# Altium project PICO核心板.PrjPcb
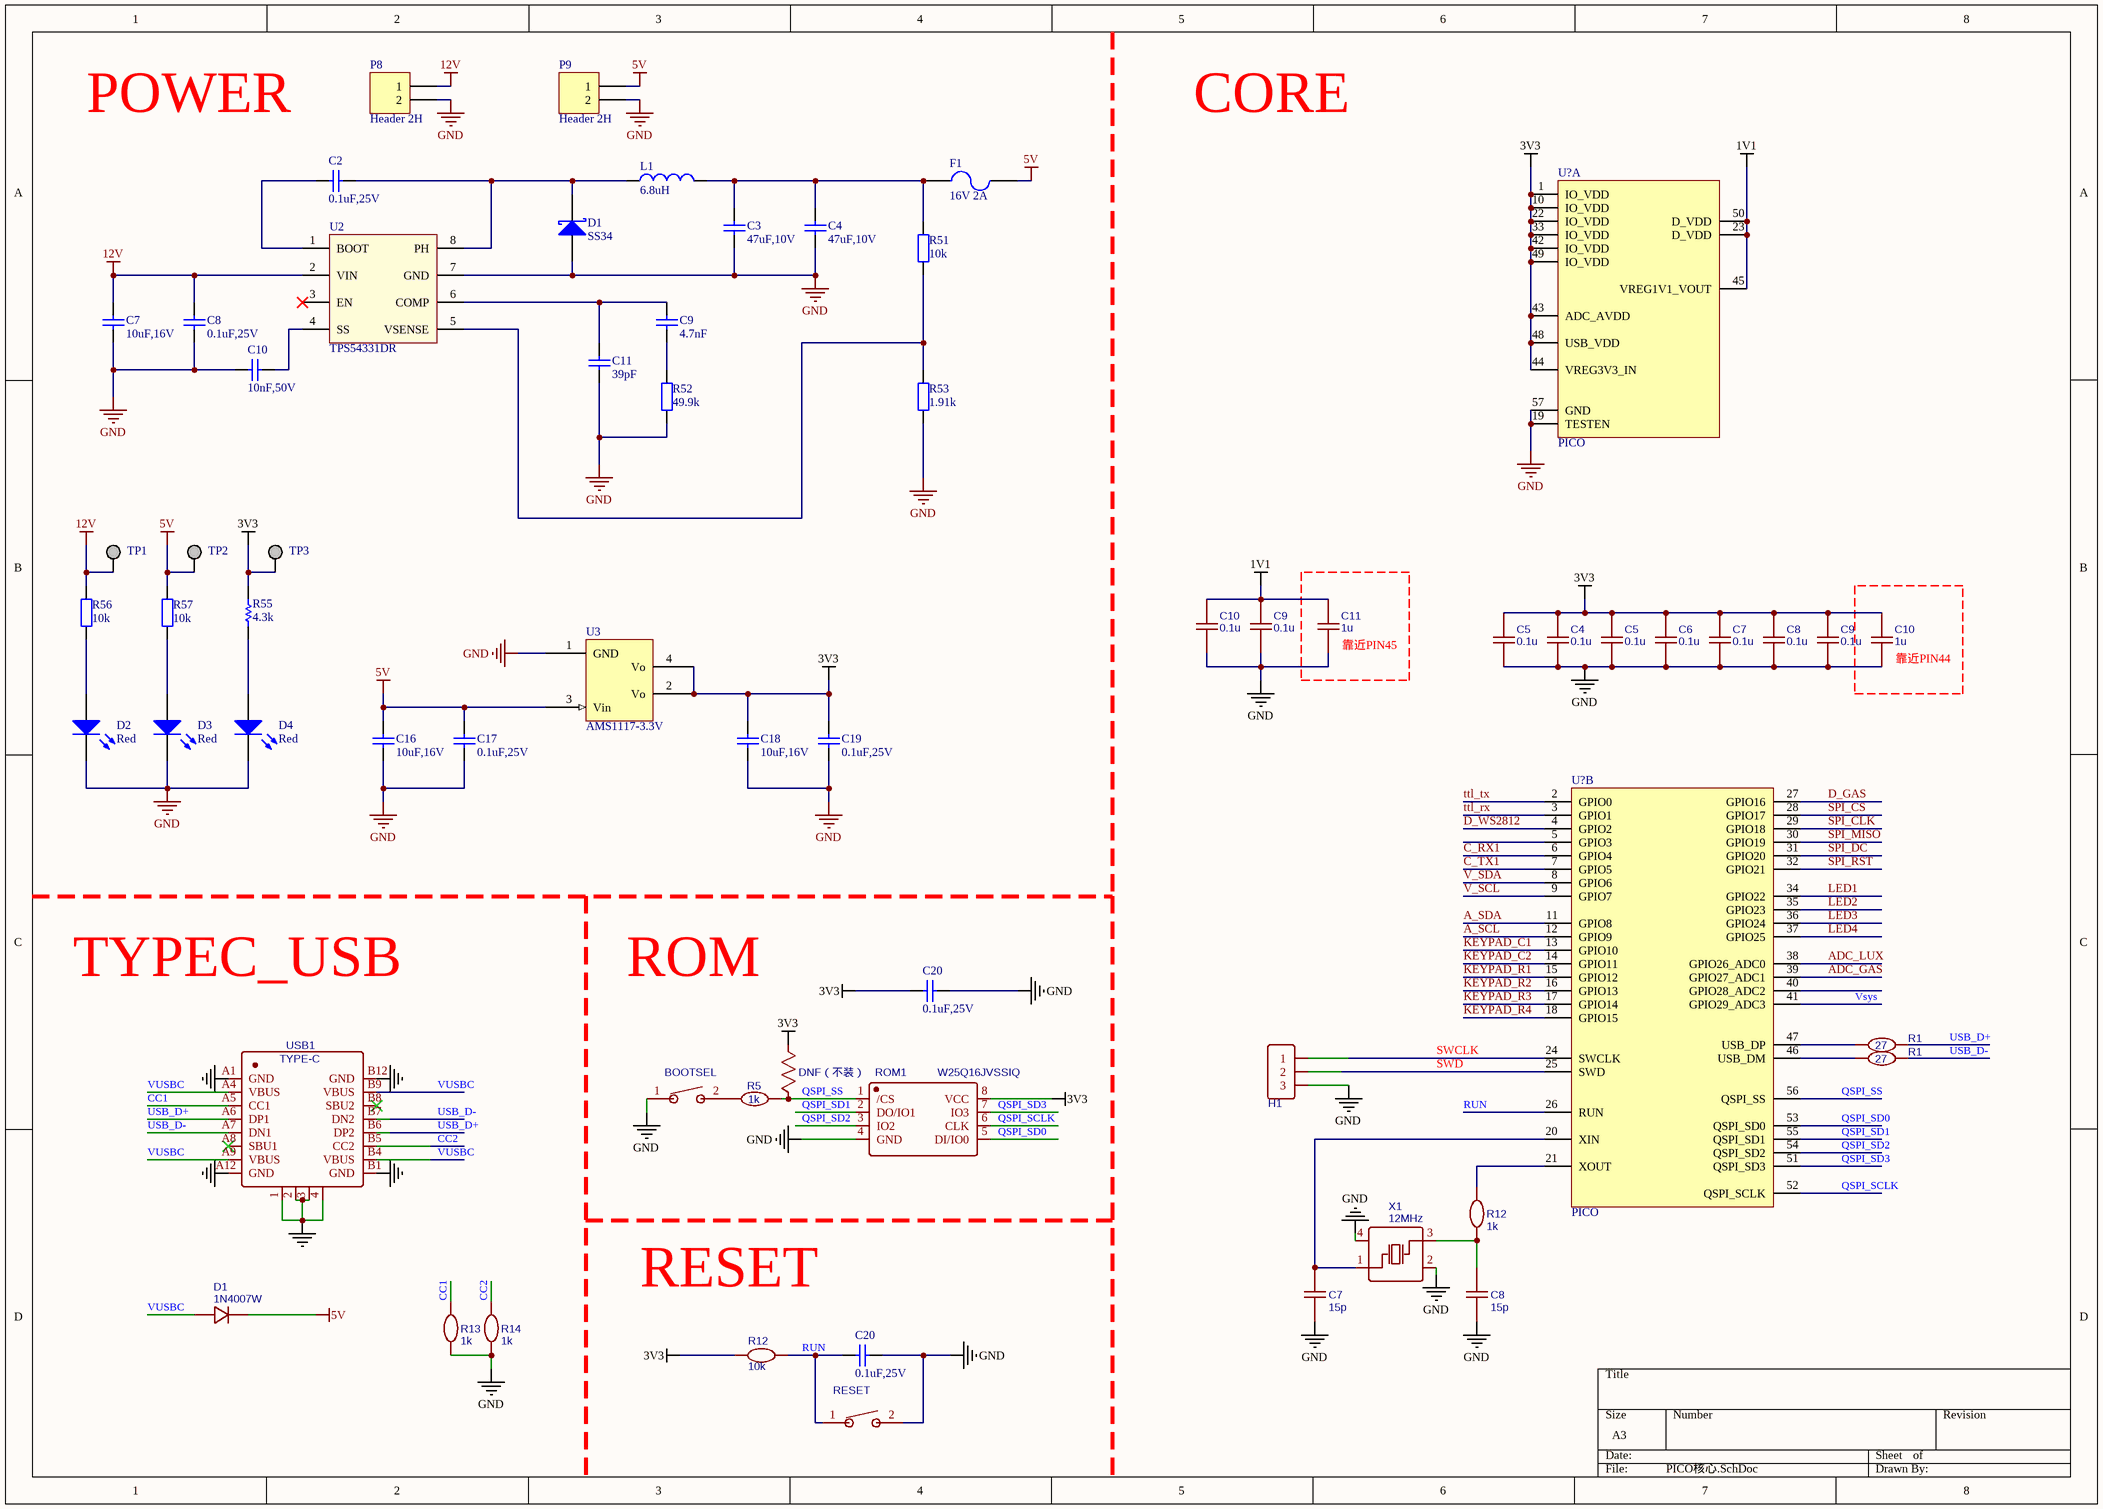
[diagram p0: PICO核心.SchDoc]
3 sheets, 124 parts. Net scope: global (net labels, ports and power ports of the same name join across sheets).
Board file: PICO核心.PcbDoc
Sheets:
  PICO核心.SchDoc
  传感器.SchDoc
  外设.SchDoc

## Sheet PICO核心.SchDoc
size A3

### Parts
(Parts that share a designator on the sheet are numbered #1, #2 ... from top to bottom, then left to right.)
BOOTSEL  TSA343G00-250J2  [SW-SMD_L4.0-W2.9-LS5.0]  (value not drawn)
C2  value 0.1uF,25V  [0603_C]  (hidden comment: Cap)
C3  value 47uF,10V  [1206_C]  (hidden comment: Cap)
C4#1  value 47uF,10V  [1206_C]  (hidden comment: Cap)
C4#2  0.1u  [C0603 NSK]
C5#1  0.1u  [C0603 NSK]
C5#2  0.1u  [C0603 NSK]
C6#1  0.1u  [C0603 NSK]
C7#1  value 10uF,16V  [0603_C]  (hidden comment: Cap)
C7#2  0.1u  [C0603 NSK]
C7#3  15p  [C0603 NSK]
C8#1  value 0.1uF,25V  [0603_C]  (hidden comment: Cap)
C8#2  0.1u  [C0603 NSK]
C8#3  15p  [C0603 NSK]
C9#1  4.7nF  [0603_C]
C9#2  0.1u  [C0603 NSK]
C9#3  0.1u  [C0603 NSK]
C10#1  value 10nF,50V  [0603_C]  (hidden comment: Cap)
C10#2  0.1u  [C0603 NSK]
C10#3  1u  [C0603 NSK]
C11#1  39pF  [0603_C]
C11#2  1u  [C0603 NSK]
C16  value 10uF,16V  [0603_C]  (hidden comment: Cap)
C17  value 0.1uF,25V  [0603_C]  (hidden comment: Cap)
C18  value 10uF,16V  [0603_C]  (hidden comment: Cap)
C19  value 0.1uF,25V  [0603_C]  (hidden comment: Cap)
C20#1  value 0.1uF,25V  [0603_C]  (hidden comment: Cap)
C20#2  value 0.1uF,25V  [0603_C]  (hidden comment: Cap)
D1#1  value SS34  [DO-214AC]  (hidden comment: Diode Schottky)
D1#2  1N4007W  [SOD-123 NSK]
D2  value Red  [0805_LED]  (hidden comment: LED)
D3  value Red  [0805_LED]  (hidden comment: LED)
D4#1  value Red  [0805_LED]  (hidden comment: LED)
F1  16V 2A  [PTC-1812]
H1  HDR-F-2.54_1x3  [HDR-F-2.54_1X3]  (value not drawn)
L1  6.8uH  [6045_L]
P8  Header 2H  [KF2EDGK3.50H-2P]
P9  Header 2H  [KF2EDGK3.50H-2P]
R1#1  27  [R0603 NSK]
R1#2  27  [R0603 NSK]
R4  DNF（不装）  [R0603 NSK]
R5#1  1k  [R0603 NSK]
R12#1  1k  [R0603 NSK]
R12#2  10k  [R0603 NSK]
R13#1  1k  [R0603 NSK]
R14  1k  [R0603 NSK]
R51  value 10k  [0603_R]  (hidden comment: Res)
R52  49.9k  [0603_R]
R53  1.91k  [0603_R]
R55#1  value 4.3k  [0603_R]  (hidden comment: Res_5%)
R56#1  value 10k  [0603_R]  (hidden comment: Res)
R57#1  value 10k  [0603_R]  (hidden comment: Res)
RESET  TSA343G00-250J2  [SW-SMD_L4.0-W2.9-LS5.0]  (value not drawn)
ROM1  W25Q16JVSSIQ  [SOIC-8_L5.3-W5.3-P1.27-LS8.0-BL]
TP1  TP  [TP_H]  (value not drawn)  (no BOM)
TP2  TP  [TP_H]  (value not drawn)  (no BOM)
TP3#1  TP  [TP_H]  (value not drawn)  (no BOM)
U2  TPS54331DR  [SOIC8E]
U3#1  value AMS1117-3.3V  [SOT223]  (hidden comment: AMS1117)
U?#1  PICO  (part A of 2)
U?#2  PICO  (part B of 2)
USB1  TYPE-C  [USB-C-SMD_TYC-302-16]
X1  12MHz  [OSC-SMD_4P-L3.2-W2.5-BL-1]

### Blocks framed on the sheet
靠近PIN45: C11#2
靠近PIN44: C10#3

### Nets
1V1: C9#2.1 C10#2.1 C11#2.2 U?#1.23(D_VDD) U?#1.45(VREG1V1_VOUT) U?#1.50(D_VDD)
3V3: C4#2.2 C5#1.1 C5#2.2 C6#1.2 C7#2.2 C8#2.2 C9#3.2 C10#3.2 C18.2 C19.2 C20#1.2 R4.2 R12#2.2 R55#1.2 ROM1.8(VCC) TP3#1.1 U3#1.2(Vo) U3#1.4(Vo) U?#1.1(IO_VDD) U?#1.10(IO_VDD) U?#1.22(IO_VDD) U?#1.33(IO_VDD) U?#1.42(IO_VDD) U?#1.43(ADC_AVDD) U?#1.44(VREG3V3_IN) U?#1.48(USB_VDD) U?#1.49(IO_VDD)
5V: C16.2 C17.2 D1#2.1 F1.2 P9.1 R57#1.2 TP2.1 U3#1.3(Vin)
12V: C7#1.2 C8#1.2 P8.1 R56#1.2 TP1.1 U2.2(VIN)
GND: BOOTSEL.1 C3.1 C4#1.1 C4#2.1 C5#1.2 C5#2.1 C6#1.1 C7#1.1 C7#2.1 C7#3.1 C8#1.1 C8#2.1 C8#3.1 C9#2.2 C9#3.1 C10#1.2 C10#2.2 C10#3.1 C11#1.1 C11#2.1 C16.1 C17.1 C18.1 C19.1 C20#1.1 C20#2.2 D1#1.1(A) D2.2(K) D3.2(K) D4#1.2(K) H1.3 P8.2 P9.2 R13#1.1 R14.1 R52.1 R53.1 RESET.2 ROM1.4(GND) U2.7(GND) U3#1.1(GND) U?#1.19(TESTEN) U?#1.57(GND) USB1.1 USB1.2 USB1.3 USB1.4 USB1.A1(GND) USB1.A12(GND) USB1.B1(GND) USB1.B12(GND) X1.2(GND) X1.4(GND)
A_SCL: U?#2.12(GPIO9)
A_SDA: U?#2.11(GPIO8)
ADC_GAS: U?#2.39(GPIO27_ADC1)
ADC_LUX: U?#2.38(GPIO26_ADC0)
C_RX1: U?#2.6(GPIO4)
C_TX1: U?#2.7(GPIO5)
CC1: R13#1.2 USB1.A5(CC1)
CC2: R14.2 USB1.B5(CC2)
D_GAS: U?#2.27(GPIO16)
D_WS2812: U?#2.4(GPIO2)
KEYPAD_C1: U?#2.13(GPIO10)
KEYPAD_C2: U?#2.14(GPIO11)
KEYPAD_R1: U?#2.15(GPIO12)
KEYPAD_R2: U?#2.16(GPIO13)
KEYPAD_R3: U?#2.17(GPIO14)
KEYPAD_R4: U?#2.18(GPIO15)
LED1: U?#2.34(GPIO22)
LED2: U?#2.35(GPIO23)
LED3: U?#2.36(GPIO24)
LED4: U?#2.37(GPIO25)
QSPI_SCLK: ROM1.6(CLK) U?#2.52(QSPI_SCLK)
QSPI_SD0: ROM1.5(DI/IO0) U?#2.53(QSPI_SD0)
QSPI_SD1: ROM1.2(DO/IO1) U?#2.55(QSPI_SD1)
QSPI_SD2: ROM1.3(IO2) U?#2.54(QSPI_SD2)
QSPI_SD3: ROM1.7(IO3) U?#2.51(QSPI_SD3)
QSPI_SS: R4.1 R5#1.2 ROM1.1(/CS) U?#2.56(QSPI_SS)
RUN: C20#2.1 R12#2.1 RESET.1 U?#2.26(RUN)
SPI_CLK: U?#2.29(GPIO18)
SPI_CS: U?#2.28(GPIO17)
SPI_DC: U?#2.31(GPIO20)
SPI_MISO: U?#2.30(GPIO19)
SPI_RST: U?#2.32(GPIO21)
ttl_rx: U?#2.3(GPIO1)
ttl_tx: U?#2.2(GPIO0)
USB_D+: R1#1.2 USB1.A6(DP1) USB1.B6(DP2)
USB_D-: R1#2.2 USB1.A7(DN1) USB1.B7(DN2)
V_SCL: U?#2.9(GPIO7)
V_SDA: U?#2.8(GPIO6)
Vsys: U?#2.41(GPIO29_ADC3)
VUSBC: D1#2.2 USB1.A4(VBUS) USB1.A9(VBUS) USB1.B4(VBUS) USB1.B9(VBUS)
NetBOOTSEL_2: BOOTSEL.2 R5#1.1
NetC2_1: C2.1 D1#1.2(K) L1.1 U2.8(PH)
NetC2_2: C2.2 U2.1(BOOT)
NetC3_2: C3.2 C4#1.2 F1.1 L1.2 R51.2
NetC7#3_2: C7#3.2 U?#2.20(XIN) X1.1(OSC1)
NetC8#3_2: C8#3.2 R12#1.1 X1.3(OSC2)
NetC9#1_1: C9#1.1 R52.2
NetC9#1_2: C9#1.2 C11#1.2 U2.6(COMP)
NetC10#1_1: C10#1.1 U2.4(SS)
NetD2_1: D2.1(A) R56#1.1
NetD3_1: D3.1(A) R57#1.1
NetD4#1_1: D4#1.1(A) R55#1.1
NetH1_1: H1.1 U?#2.24(SWCLK)
NetH1_2: H1.2 U?#2.25(SWD)
NetR1#1_1: R1#1.1 U?#2.47(USB_DP)
NetR1#2_1: R1#2.1 U?#2.46(USB_DM)
NetR12#1_2: R12#1.2 U?#2.21(XOUT)
NetR51_1: R51.1 R53.2 U2.5(VSENSE)

Not connected (* = marked no-connect by the designer): U2 3(EN)*; U?#2 5(GPIO3) 40(GPIO28_ADC2); USB1 A8(SBU1)* B8(SBU2)*

### Notes on the sheet
- POWER
- CORE
- TYPEC_USB
- ROM
- SWCLK
- SWD
- RESET

### Library data of the parts
BOOTSEL RESET = TSA343G00-250J2: BOM_Manufacturer: BRIGHT; Contributor: LCSC; BOM_Supplier: LCSC; BOM_Supplier Part: C354946; BOM_Manufacturer Part: TSA343G00-250J2; BOM_JLCPCB Part Class: Extended Part; spicePre: S; spiceSymbolName: TSA343G00-250J2
C2 C8#1 C17 C19 C20#1 C20#2 = T_Cap_0603_0.1uF_25V_X5R: 贴片电容; Part Typer: X5R; Solder: SMD; Withstand Voltage: 25V; Tolerance: 10%; Schematic Path: X:\Database\Schematic Library.Schlib; Part Number: T_Cap_0603_0.1uF_25V_X5R; LibRef: T_Cap_0603_0.1uF_25V_X5R
C3 C4#1 = T_Cap_1206_47uF_10V_X5R: 贴片电容; Part Typer: X5R; Solder: SMD; Withstand Voltage: 10V; Tolerance: 10%; Schematic Path: X:\Database\Schematic Library.Schlib; Part Number: T_Cap_1206_47uF_10V_X5R; LibRef: T_Cap_1206_47uF_10V_X5R
C4#2 C5#1 C5#2 C6#1 C7#2 C8#2 C9#2 C9#3 C10#2 C10#3 C11#2 = 0.1u: nameAlias: Value(F); Contributor: LCEDA_Lib; spicePre: C; spiceSymbolName: C_0603_US
C7#1 C16 C18 = T_Cap_0603_10uF_16V_X5R: 贴片电容; Part Typer: X5R; Solder: SMD; Withstand Voltage: 16V; Tolerance: 10%; Schematic Path: X:\Database\Schematic Library.Schlib; Part Number: T_Cap_0603_10uF_16V_X5R; LibRef: T_Cap_0603_10uF_16V_X5R
C7#3 = 15p: nameAlias: Value(F); Contributor: LCEDA_Lib; spicePre: C; spiceSymbolName: C_0603_US
C8#3 = 15p: nameAlias: Value(F); Contributor: LCEDA_Lib; Package Display: No; spicePre: C; spiceSymbolName: C_0603_US
C9#1 C11#1 = Cap
C10#1 = T_Cap_0603_10nF_50V_X7R: 贴片电容; Part Typer: X7R; Solder: SMD; Withstand Voltage: 50V; Tolerance: 10%; Schematic Path: X:\Database\Schematic Library.Schlib; Part Number: T_Cap_0603_10nF_50V_X7R; LibRef: T_Cap_0603_10nF_50V_X7R
D1#1 = T_SS34: 肖特基二极管; Part Number: T_SS34; Solder: SMD; Schematic Path: X:\Database\Schematic Library.Schlib; LibRef: T_SS34
D1#2 = 1N4007W: BOM_Manufacturer: BLUE ROCKET; Contributor: LCEDA_Lib; BOM_Supplier: LCSC; BOM_Supplier Part: C328592; BOM_Manufacturer Part: 1N4007W; spicePre: D; spiceSymbolName: 1N4007W
D2 D3 D4#1 = T_LED_Red_0805: 红色LED灯; Solder: SMD; Schematic Path: X:\Database\Schematic Library.Schlib; Part Number: T_LED_Red_0805; LibRef: T_LED_Red_0805
F1 = Fuse
H1 = HDR-F-2.54_1x3: Contributor: LCEDA_Lib; BOM_Supplier Part: C146690; BOM_Supplier: LCSC; spicePre: H; spiceSymbolName: HDR-F-2.54_1x3
L1 = Inductor
P8 P9 = Header 2H: Header, 2-Pin, Right Angle; LatestRevisionDate: 17-Jul-2002; LatestRevisionNote: Re-released for DXP Platform.; Publisher: Altium Limited
R1#1 R1#2 = 27: nameAlias: Value(Ω); Contributor: LCEDA_Lib; spicePre: R; spiceSymbolName: R_0603_EU
R4 = DNF（不装）: nameAlias: Value(Ω); Contributor: LCEDA_Lib; spicePre: R; spiceSymbolName: R_0603_US
R5#1 R12#1 R12#2 R13#1 R14 = 1k: nameAlias: Value(Ω); Contributor: LCEDA_Lib; spicePre: R; spiceSymbolName: R_0603_EU
R51 R56#1 R57#1 = T_Res_0603_10k_1%_1/10W: 贴片电阻; Solder: SMD; Power: 1/10W; Tolerance: 1%; Schematic Path: X:\Database\Schematic Library.Schlib; Part Number: T_Res_0603_10k_1%_1/10W; LibRef: T_Res_0603_10k_1%_1/10W
R52 R53 = Res
R55#1 = T_Res_0603_4.3k_5%_1/10W: 贴片电阻; Solder: SMD; Power: 1/10W; Tolerance: 5%; Schematic Path: X:\Database\Schematic Library.Schlib; Part Number: T_Res_0603_4.3k_5%_1/10W; LibRef: T_Res_0603_4.3k_5%_1/10W
ROM1 = W25Q16JVSSIQ: BOM_Manufacturer: WINBOND; BOM_Supplier: LCSC; BOM_Manufacturer Part: W25Q16JVSSIQ; BOM_Supplier Part: C82317; BOM_JLCPCB Part Class: Extended Part; spicePre: U; spiceSymbolName: W25Q16JVSSIQ
TP1 TP2 TP3#1 = T_TestPoint_H: 测试点_过孔; Solder: DIP; Schematic Path: X:\Database\Schematic Library.Schlib; Part Number: T_TestPoint_H; LibRef: T_TestPoint_H
U2 = TPS54331: TI, 3A, 3.5-28V, Buck
U3#1 = T_AMS1117-3.3V: 电源芯片; Solder: SMD; Schematic Path: X:\Database\Schematic Library.Schlib; Part Number: T_AMS1117-3.3V; LibRef: T_AMS1117-3.3V; ComponentLink2Description: Datasheet; ComponentLink2URL: X:\Database\Datasheet\AMS1117.pdf
U?#1 U?#2 = PICO_CORE
USB1 = TYPE-C: BOM_Manufacturer: XUNPU; BOM_Manufacturer Part: TYC-302-16; Contributor: LCSC; Package Display: No; BOM_Supplier: LCSC; BOM_Supplier Part: C381477; spicePre: U; spiceSymbolName: TYC-302-16
X1 = 12MHz: BOM_Manufacturer: YXC; BOM_Manufacturer Part: X322512MLB4SI; nameAlias: Frequency; BOM_Supplier: LCSC; BOM_Supplier Part: C112971; BOM_JLCPCB Part Class: Extended Part; spicePre: X; spiceSymbolName: X322512MLB4SI

## Sheet 传感器.SchDoc
size A4
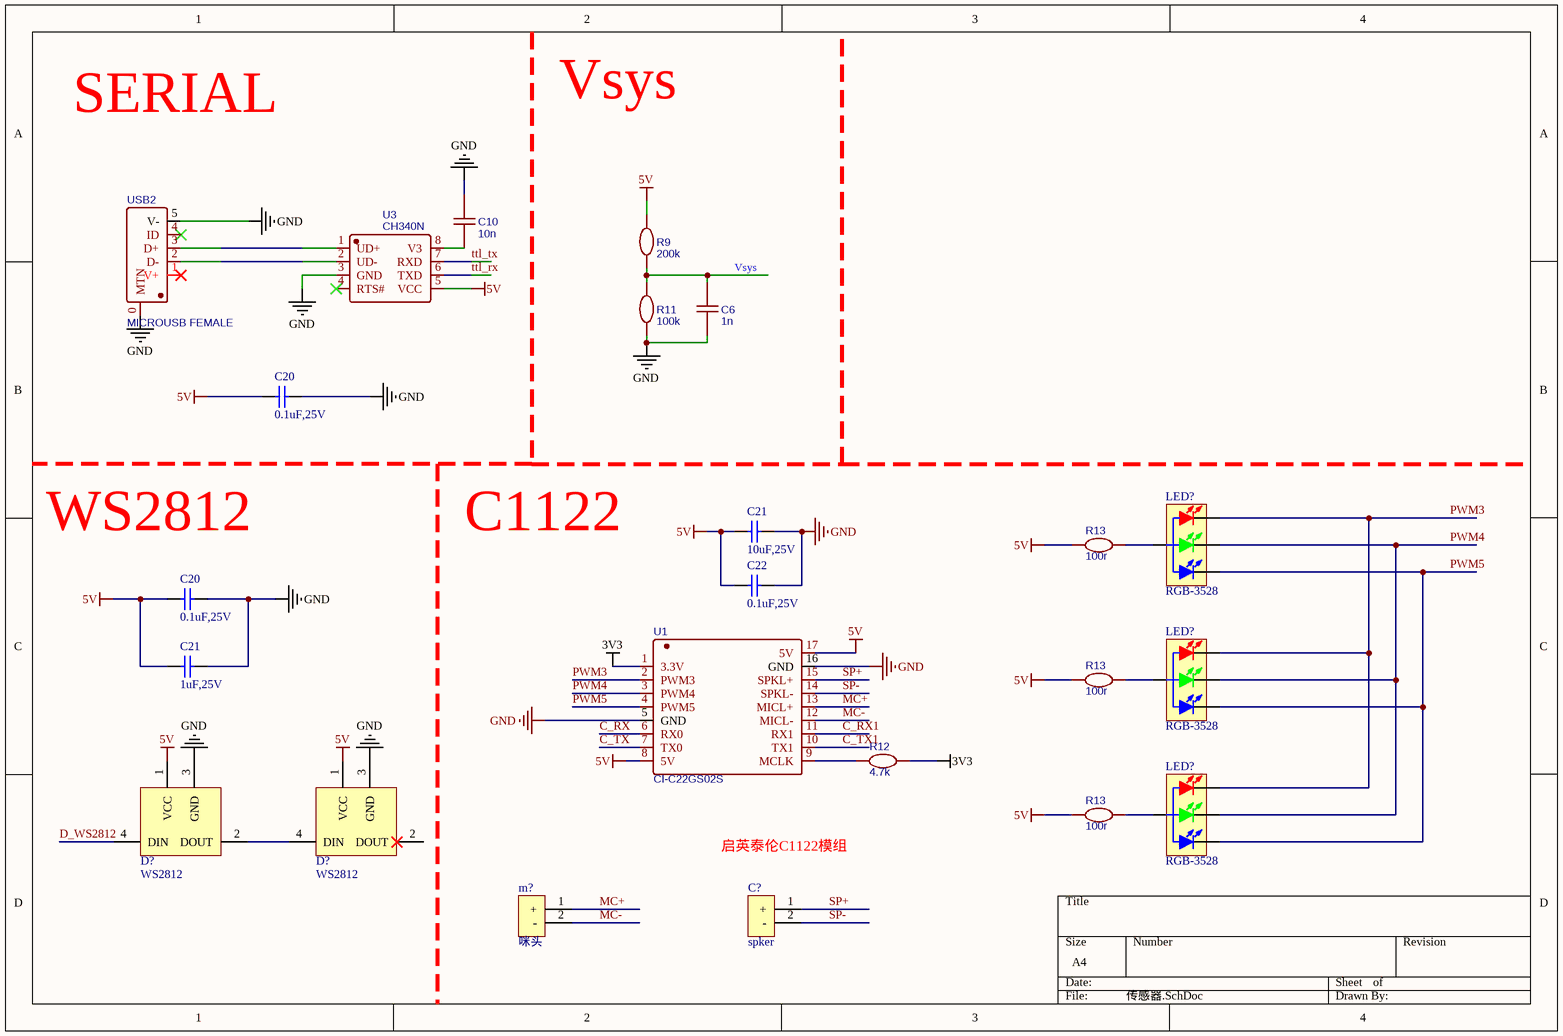
[diagram p1: 传感器.SchDoc]

### Parts
(Parts that share a designator on the sheet are numbered #1, #2 ... from top to bottom, then left to right.)
C6#2  1n  [C0603 NSK]
C10#4  10n  [C0603 NSK]
C20#3  value 0.1uF,25V  [0603_C]  (hidden comment: Cap)
C20#4  value 0.1uF,25V  [0603_C]  (hidden comment: Cap)
C21#1  value 10uF,25V  [0603_C]  (hidden comment: Cap)
C21#2  value 1uF,25V  [0603_C]  (hidden comment: Cap)
C22#1  value 0.1uF,25V  [0603_C]  (hidden comment: Cap)
C?  spker
D?#1  WS2812
D?#2  WS2812
LED?#1  RGB-3528  [LED 3528-4Pin]
LED?#2  RGB-3528  [LED 3528-4Pin]
LED?#3  RGB-3528  [LED 3528-4Pin]
m?  咪头
R9  200k  [R0603 NSK]
R11  100k  [R0603 NSK]
R12#3  4.7k  [R0603 NSK]
R13#2  100r  [R0603 NSK]
R13#3  100r  [R0603 NSK]
R13#4  100r  [R0603 NSK]
U1  CI-C22GS02S  [SMD-17_L20.0-W1.80-CI-C22GS02S]
U3#2  CH340N  [SOP-8_L5.0-W4.0-P1.27-LS6.0-BL]
USB2  MICROUSB FEMALE  [MICRO-USB-SMD_5P-P0.65-H-F_C10418]

### Nets
3V3: R12#3.1 U1.1(3.3V)
5V: C20#3.2 C20#4.2 C21#1.1 C21#2.2 C22#1.1 D?#1.1(VCC) D?#2.1(VCC) R9.2 R13#2.2 R13#3.2 R13#4.2 U1.8(5V) U1.17(5V) U3#2.5(VCC)
GND: C6#2.1 C10#4.2 C20#3.1 C20#4.1 C21#1.2 C21#2.1 C22#1.2 D?#1.3(GND) D?#2.3(GND) R11.1 U1.5(GND) U1.16(GND) U3#2.3(GND) USB2.0(MTN) USB2.5(V-)
C_RX: U1.6(RX0)
C_RX1: U1.11(RX1)
C_TX: U1.7(TX0)
C_TX1: U1.10(TX1)
D_WS2812: D?#1.4(DIN)
MC+: m?.1(+) U1.13(MICL+)
MC-: m?.2(-) U1.12(MICL-)
PWM3: LED?#1.1(RED_K) LED?#2.1(RED_K) LED?#3.1(RED_K) U1.2(PWM3)
PWM4: LED?#1.3(GREEN_K) LED?#2.3(GREEN_K) LED?#3.3(GREEN_K) U1.3(PWM4)
PWM5: LED?#1.4(BULE_K) LED?#2.4(BULE_K) LED?#3.4(BULE_K) U1.4(PWM5)
SP+: C?.1(+) U1.15(SPKL+)
SP-: C?.2(-) U1.14(SPKL-)
ttl_rx: U3#2.6(TXD)
ttl_tx: U3#2.7(RXD)
Vsys: C6#2.2 R9.1 R11.2
NetC10#4_1: C10#4.1 U3#2.8(V3)
NetD?#1_2: D?#1.2(DOUT) D?#2.4(DIN)
NetLED?#1_2: LED?#1.2(A) R13#2.1
NetLED?#2_2: LED?#2.2(A) R13#3.1
NetLED?#3_2: LED?#3.2(A) R13#4.1
NetR12#3_2: R12#3.2 U1.9(MCLK)
NetU3#2_1: U3#2.1(UD+) USB2.3(D+)
NetU3#2_2: U3#2.2(UD-) USB2.2(D-)

Not connected (* = marked no-connect by the designer): D?#2 2(DOUT); U3#2 4(RTS#)*; USB2 1(V+)* 4(ID)*

### Notes on the sheet
- Vsys
- SERIAL
- WS2812
- C1122
- 启英泰伦C1122模组

### Library data of the parts
C6#2 = 1n: nameAlias: Value(F); Contributor: LCEDA_Lib; spicePre: C; spiceSymbolName: C_0603_US
C10#4 = 10n: nameAlias: Value(F); Contributor: LCEDA_Lib; spicePre: C; spiceSymbolName: C_0603_US
C20#3 C20#4 C21#1 C21#2 C22#1 = T_Cap_0603_0.1uF_25V_X5R: as C2 on sheet PICO核心; Part Number: T_Cap_0603_0.1uF_25V_X5R; LibRef: T_Cap_0603_0.1uF_25V_X5R
C? = SPK
LED?#1-LED?#3 = LED-RGB-3528: 三基色LED; 版权归属: 源创客; BOM名称: 三基色LED; 学习资源: www.ooocke.com
m? = mic
R9 = 200k: nameAlias: Value(Ω); Contributor: LCEDA_Lib; spicePre: R; spiceSymbolName: R_0603_EU
R11 R12#3 R13#2-R13#4 = 100k: nameAlias: Value(Ω); Contributor: LCEDA_Lib; spicePre: R; spiceSymbolName: R_0603_EU
U1 = CI-C22GS02S: BOM_Manufacturer: Chiplntelli(启英泰伦); Contributor: LCSC; BOM_Supplier: LCSC; BOM_Supplier Part: C2759836; BOM_Manufacturer Part: CI-C22GS02S; BOM_JLCPCB Part Class: Extended Part; spicePre: U; spiceSymbolName: CI-C22GS02S
U3#2 = CH340N: BOM_Manufacturer: WCH(Jiangsu Qin Heng); Contributor: LCSC; BOM_Supplier: LCSC; BOM_Supplier Part: C506813; BOM_Manufacturer Part: CH340N; BOM_JLCPCB Part Class: Extended Part; spicePre: U; spiceSymbolName: CH340N
USB2 = MICROUSB FEMALE: BOM_Manufacturer: ValuePro; BOM_Supplier: LCSC; BOM_Manufacturer Part: micro USBFemale; BOM_Supplier Part: C10418; BOM_JLCPCB Part Class: Extended Part; spicePre: U; spiceSymbolName: MICROUSB FEMALE

## Sheet 外设.SchDoc
size A3
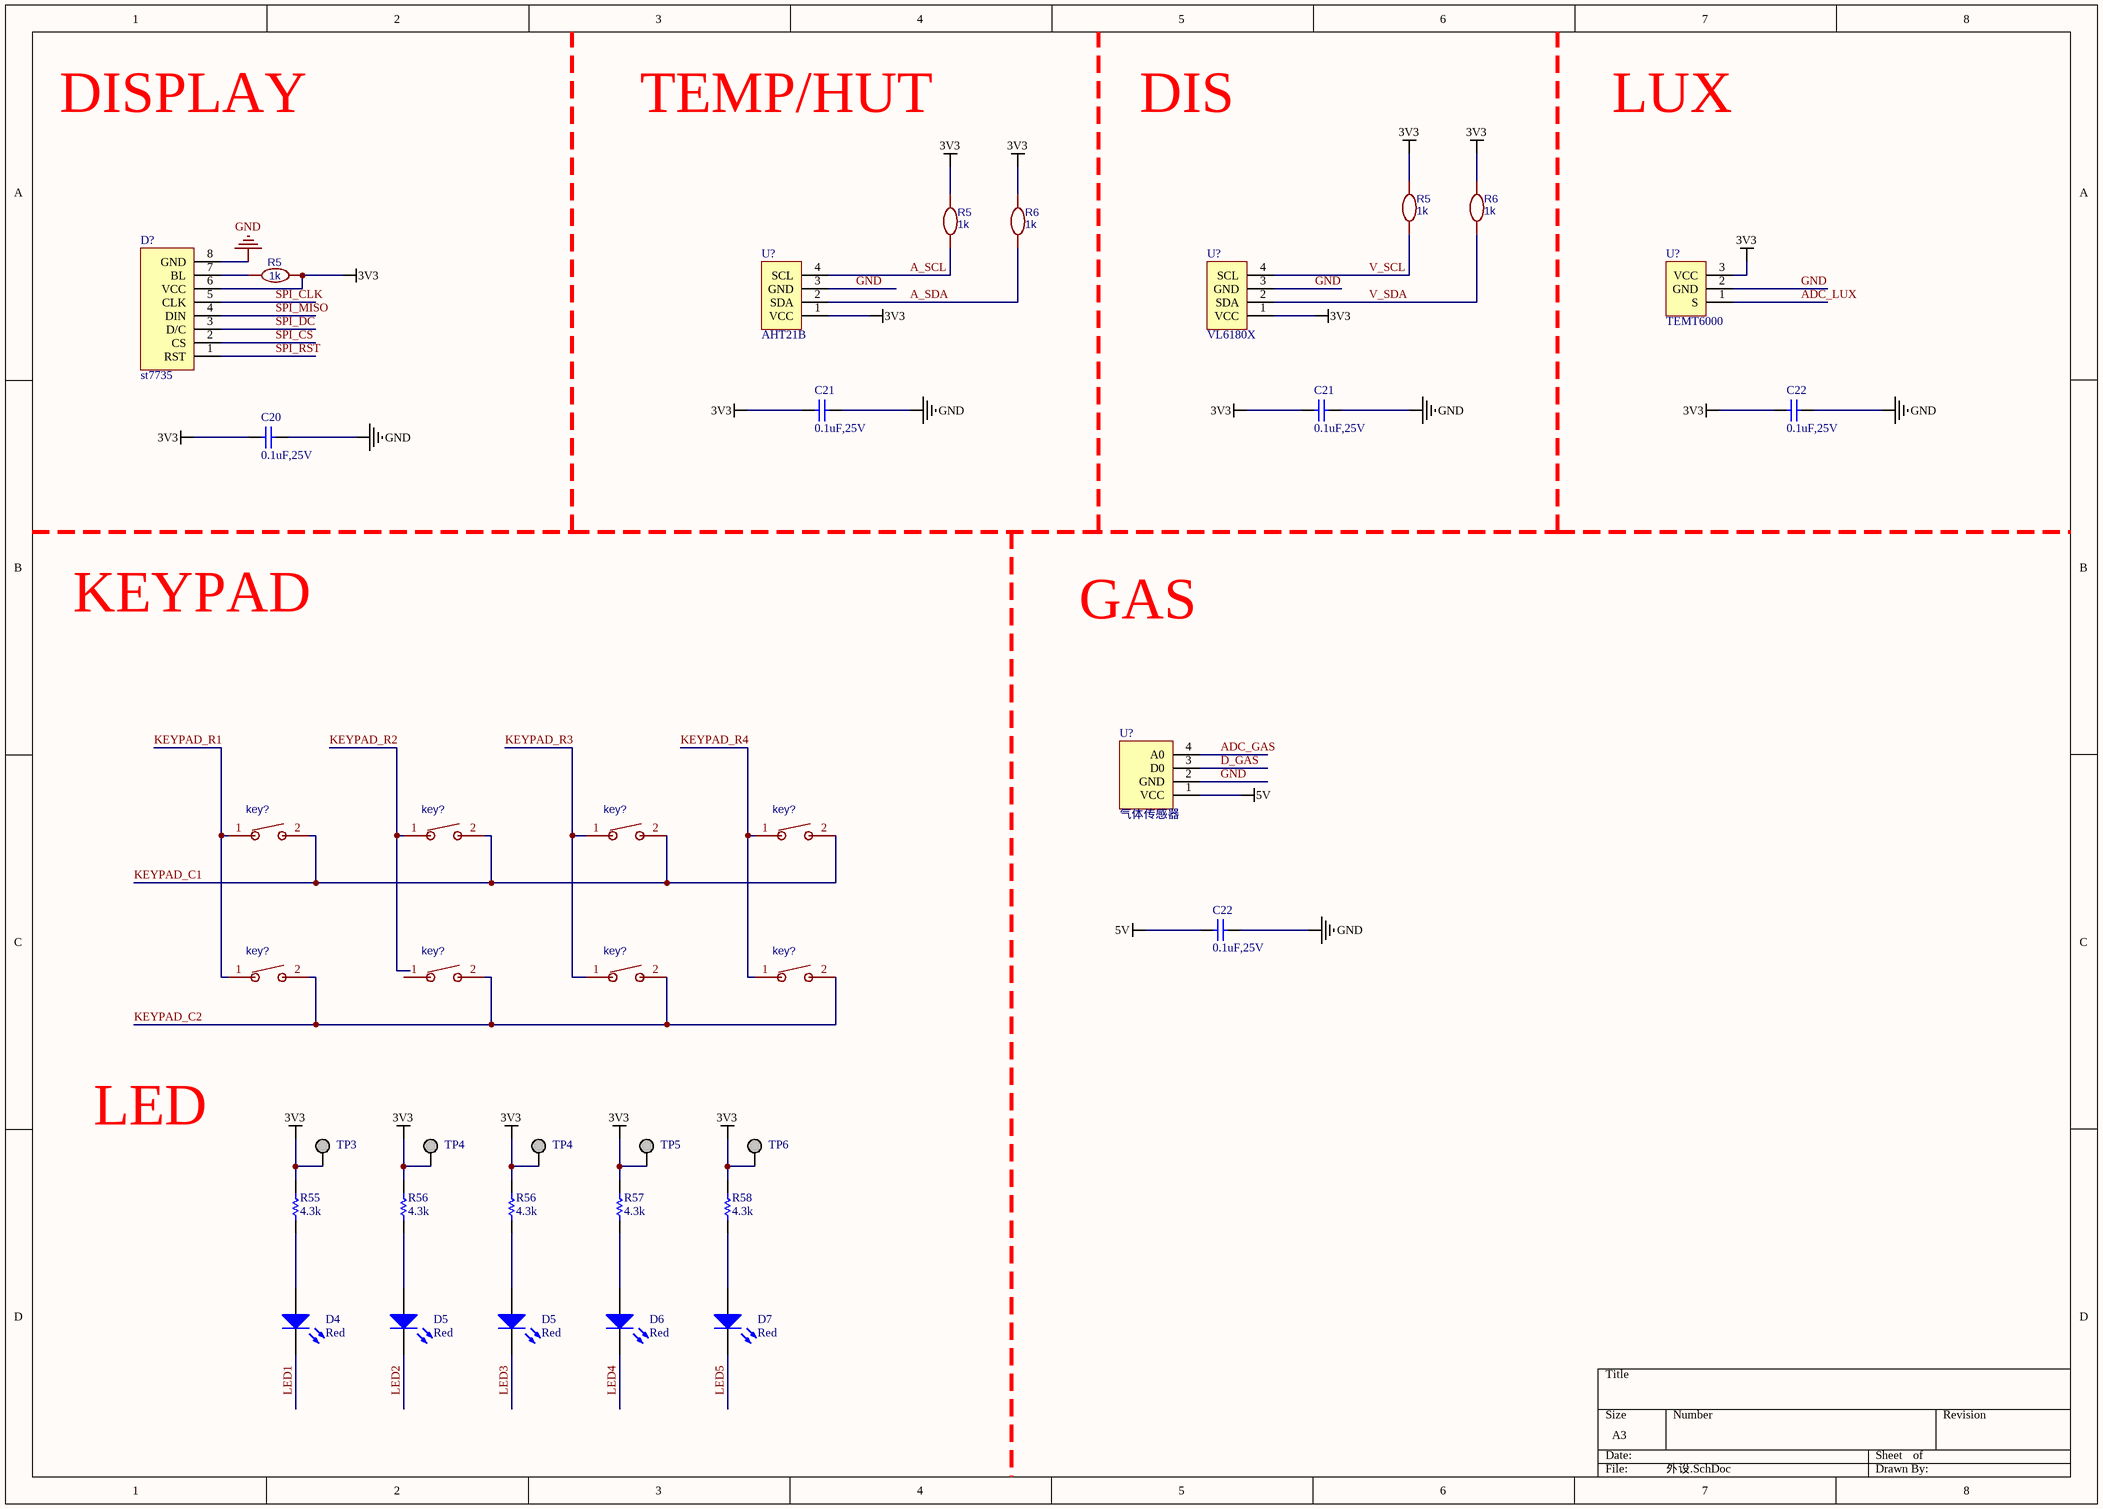
[diagram p2: 外设.SchDoc]

### Parts
(Parts that share a designator on the sheet are numbered #1, #2 ... from top to bottom, then left to right.)
C20#5  value 0.1uF,25V  [0603_C]  (hidden comment: Cap)
C21#3  value 0.1uF,25V  [0603_C]  (hidden comment: Cap)
C21#4  value 0.1uF,25V  [0603_C]  (hidden comment: Cap)
C22#2  value 0.1uF,25V  [0603_C]  (hidden comment: Cap)
C22#3  value 0.1uF,25V  [0603_C]  (hidden comment: Cap)
D4#2  value Red  [0805_LED]  (hidden comment: LED)
D5#1  value Red  [0805_LED]  (hidden comment: LED)
D5#2  value Red  [0805_LED]  (hidden comment: LED)
D6  value Red  [0805_LED]  (hidden comment: LED)
D7  value Red  [0805_LED]  (hidden comment: LED)
D?#3  st7735
key?#1  TSA343G00-250J2  [SW-SMD_L4.0-W2.9-LS5.0]  (value not drawn)
key?#2  TSA343G00-250J2  [SW-SMD_L4.0-W2.9-LS5.0]  (value not drawn)
key?#3  TSA343G00-250J2  [SW-SMD_L4.0-W2.9-LS5.0]  (value not drawn)
key?#4  TSA343G00-250J2  [SW-SMD_L4.0-W2.9-LS5.0]  (value not drawn)
key?#5  TSA343G00-250J2  [SW-SMD_L4.0-W2.9-LS5.0]  (value not drawn)
key?#6  TSA343G00-250J2  [SW-SMD_L4.0-W2.9-LS5.0]  (value not drawn)
key?#7  TSA343G00-250J2  [SW-SMD_L4.0-W2.9-LS5.0]  (value not drawn)
key?#8  TSA343G00-250J2  [SW-SMD_L4.0-W2.9-LS5.0]  (value not drawn)
R5#2  1k  [R0603 NSK]
R5#3  1k  [R0603 NSK]
R5#4  1k  [R0603 NSK]
R6#1  1k  [R0603 NSK]
R6#2  1k  [R0603 NSK]
R55#2  value 4.3k  [0603_R]  (hidden comment: Res_5%)
R56#2  value 4.3k  [0603_R]  (hidden comment: Res_5%)
R56#3  value 4.3k  [0603_R]  (hidden comment: Res_5%)
R57#2  value 4.3k  [0603_R]  (hidden comment: Res_5%)
R58  value 4.3k  [0603_R]  (hidden comment: Res_5%)
TP3#2  TP  [TP_H]  (value not drawn)  (no BOM)
TP4#1  TP  [TP_H]  (value not drawn)  (no BOM)
TP4#2  TP  [TP_H]  (value not drawn)  (no BOM)
TP5  TP  [TP_H]  (value not drawn)  (no BOM)
TP6  TP  [TP_H]  (value not drawn)  (no BOM)
U?#3  AHT21B
U?#4  VL6180X
U?#5  TEMT6000
U?#6  气体传感器

### Nets
3V3: C20#5.2 C21#3.2 C21#4.2 C22#2.2 D?#3.6(VCC) R5#2.2 R5#3.2 R5#4.2 R6#1.2 R6#2.2 R55#2.2 R56#2.2 R56#3.2 R57#2.2 R58.2 TP3#2.1 TP4#1.1 TP4#2.1 TP5.1 TP6.1 U?#3.1(VCC) U?#4.1(VCC) U?#5.3(VCC)
5V: C22#3.2 U?#6.1(VCC)
GND: C20#5.1 C21#3.1 C21#4.1 C22#2.1 C22#3.1 D?#3.8(GND) U?#3.3(GND) U?#4.3(GND) U?#5.2(GND) U?#6.2(GND)
A_SCL: R5#3.1 U?#3.4(SCL)
A_SDA: R6#2.1 U?#3.2(SDA)
ADC_GAS: U?#6.4(A0)
ADC_LUX: U?#5.1(S)
D_GAS: U?#6.3(D0)
KEYPAD_C1: key?#1.2 key?#2.2 key?#3.2 key?#4.2
KEYPAD_C2: key?#5.2 key?#6.2 key?#7.2 key?#8.2
KEYPAD_R1: key?#1.1 key?#5.1
KEYPAD_R2: key?#2.1
KEYPAD_R3: key?#3.1 key?#7.1
KEYPAD_R4: key?#4.1 key?#8.1
LED1: D4#2.2(K)
LED2: D5#1.2(K)
LED3: D5#2.2(K)
LED4: D6.2(K)
LED5: D7.2(K)
SPI_CLK: D?#3.5(CLK)
SPI_CS: D?#3.2(CS)
SPI_DC: D?#3.3(D/C)
SPI_MISO: D?#3.4(DIN)
SPI_RST: D?#3.1(RST)
V_SCL: R5#2.1 U?#4.4(SCL)
V_SDA: R6#1.1 U?#4.2(SDA)
NetD4#2_1: D4#2.1(A) R55#2.1
NetD5#1_1: D5#1.1(A) R56#2.1
NetD5#2_1: D5#2.1(A) R56#3.1
NetD6_1: D6.1(A) R57#2.1
NetD7_1: D7.1(A) R58.1
NetD?#3_7: D?#3.7(BL) R5#4.1

Not connected (* = marked no-connect by the designer): key?#6 1

### Notes on the sheet
- DISPLAY
- TEMP/HUT
- DIS
- LUX
- KEYPAD
- GAS
- LED

### Library data of the parts
C20#5 C21#3 C21#4 C22#2 C22#3 = T_Cap_0603_0.1uF_25V_X5R: as C2 on sheet PICO核心; Part Number: T_Cap_0603_0.1uF_25V_X5R; LibRef: T_Cap_0603_0.1uF_25V_X5R
D4#2 D5#1 D5#2 D6 D7 = T_LED_Red_0805: as D2 on sheet PICO核心; Part Number: T_LED_Red_0805; LibRef: T_LED_Red_0805
key?#1-key?#8 = TSA343G00-250J2: as BOOTSEL on sheet PICO核心; BOM_Supplier: LCSC; BOM_Supplier Part: C354946; BOM_Manufacturer Part: TSA343G00-250J2; BOM_JLCPCB Part Class: Extended Part; spicePre: S; spiceSymbolName: TSA343G00-250J2
R5#2-R5#4 R6#1 R6#2 = 1k: as R5#1 on sheet PICO核心; spicePre: R; spiceSymbolName: R_0603_EU
R55#2 R56#2 R56#3 R57#2 R58 = T_Res_0603_4.3k_5%_1/10W: as R55#1 on sheet PICO核心; Part Number: T_Res_0603_4.3k_5%_1/10W; LibRef: T_Res_0603_4.3k_5%_1/10W
TP3#2 TP4#1 TP4#2 TP5 TP6 = T_TestPoint_H: as TP1 on sheet PICO核心; Part Number: T_TestPoint_H; LibRef: T_TestPoint_H
U?#6 = MQ135

## Nets that join several sheets
3V3: PICO核心 (27 pins), 传感器 (R12#3.1 U1.1), 外设 (23 pins)
5V: PICO核心 (8 pins), 传感器 (14 pins), 外设 (C22#3.2 U?#6.1)
GND: PICO核心 (53 pins), 传感器 (15 pins), 外设 (10 pins)
A_SCL: PICO核心 (U?#2.12), 外设 (R5#3.1 U?#3.4)
A_SDA: PICO核心 (U?#2.11), 外设 (R6#2.1 U?#3.2)
ADC_GAS: PICO核心 (U?#2.39), 外设 (U?#6.4)
ADC_LUX: PICO核心 (U?#2.38), 外设 (U?#5.1)
C_RX1: PICO核心 (U?#2.6), 传感器 (U1.11)
C_TX1: PICO核心 (U?#2.7), 传感器 (U1.10)
D_GAS: PICO核心 (U?#2.27), 外设 (U?#6.3)
D_WS2812: PICO核心 (U?#2.4), 传感器 (D?#1.4)
KEYPAD_C1: PICO核心 (U?#2.13), 外设 (key?#1.2 key?#2.2 key?#3.2 key?#4.2)
KEYPAD_C2: PICO核心 (U?#2.14), 外设 (key?#5.2 key?#6.2 key?#7.2 key?#8.2)
KEYPAD_R1: PICO核心 (U?#2.15), 外设 (key?#1.1 key?#5.1)
KEYPAD_R2: PICO核心 (U?#2.16), 外设 (key?#2.1)
KEYPAD_R3: PICO核心 (U?#2.17), 外设 (key?#3.1 key?#7.1)
KEYPAD_R4: PICO核心 (U?#2.18), 外设 (key?#4.1 key?#8.1)
LED1: PICO核心 (U?#2.34), 外设 (D4#2.2)
LED2: PICO核心 (U?#2.35), 外设 (D5#1.2)
LED3: PICO核心 (U?#2.36), 外设 (D5#2.2)
LED4: PICO核心 (U?#2.37), 外设 (D6.2)
SPI_CLK: PICO核心 (U?#2.29), 外设 (D?#3.5)
SPI_CS: PICO核心 (U?#2.28), 外设 (D?#3.2)
SPI_DC: PICO核心 (U?#2.31), 外设 (D?#3.3)
SPI_MISO: PICO核心 (U?#2.30), 外设 (D?#3.4)
SPI_RST: PICO核心 (U?#2.32), 外设 (D?#3.1)
ttl_rx: PICO核心 (U?#2.3), 传感器 (U3#2.6)
ttl_tx: PICO核心 (U?#2.2), 传感器 (U3#2.7)
V_SCL: PICO核心 (U?#2.9), 外设 (R5#2.1 U?#4.4)
V_SDA: PICO核心 (U?#2.8), 外设 (R6#1.1 U?#4.2)
Vsys: PICO核心 (U?#2.41), 传感器 (C6#2.2 R9.1 R11.2)